# Altium schematic sheet MCU_CAN.SchDoc
size 310 x 201 mm; SheetNumber: 7; SheetTotal: 7
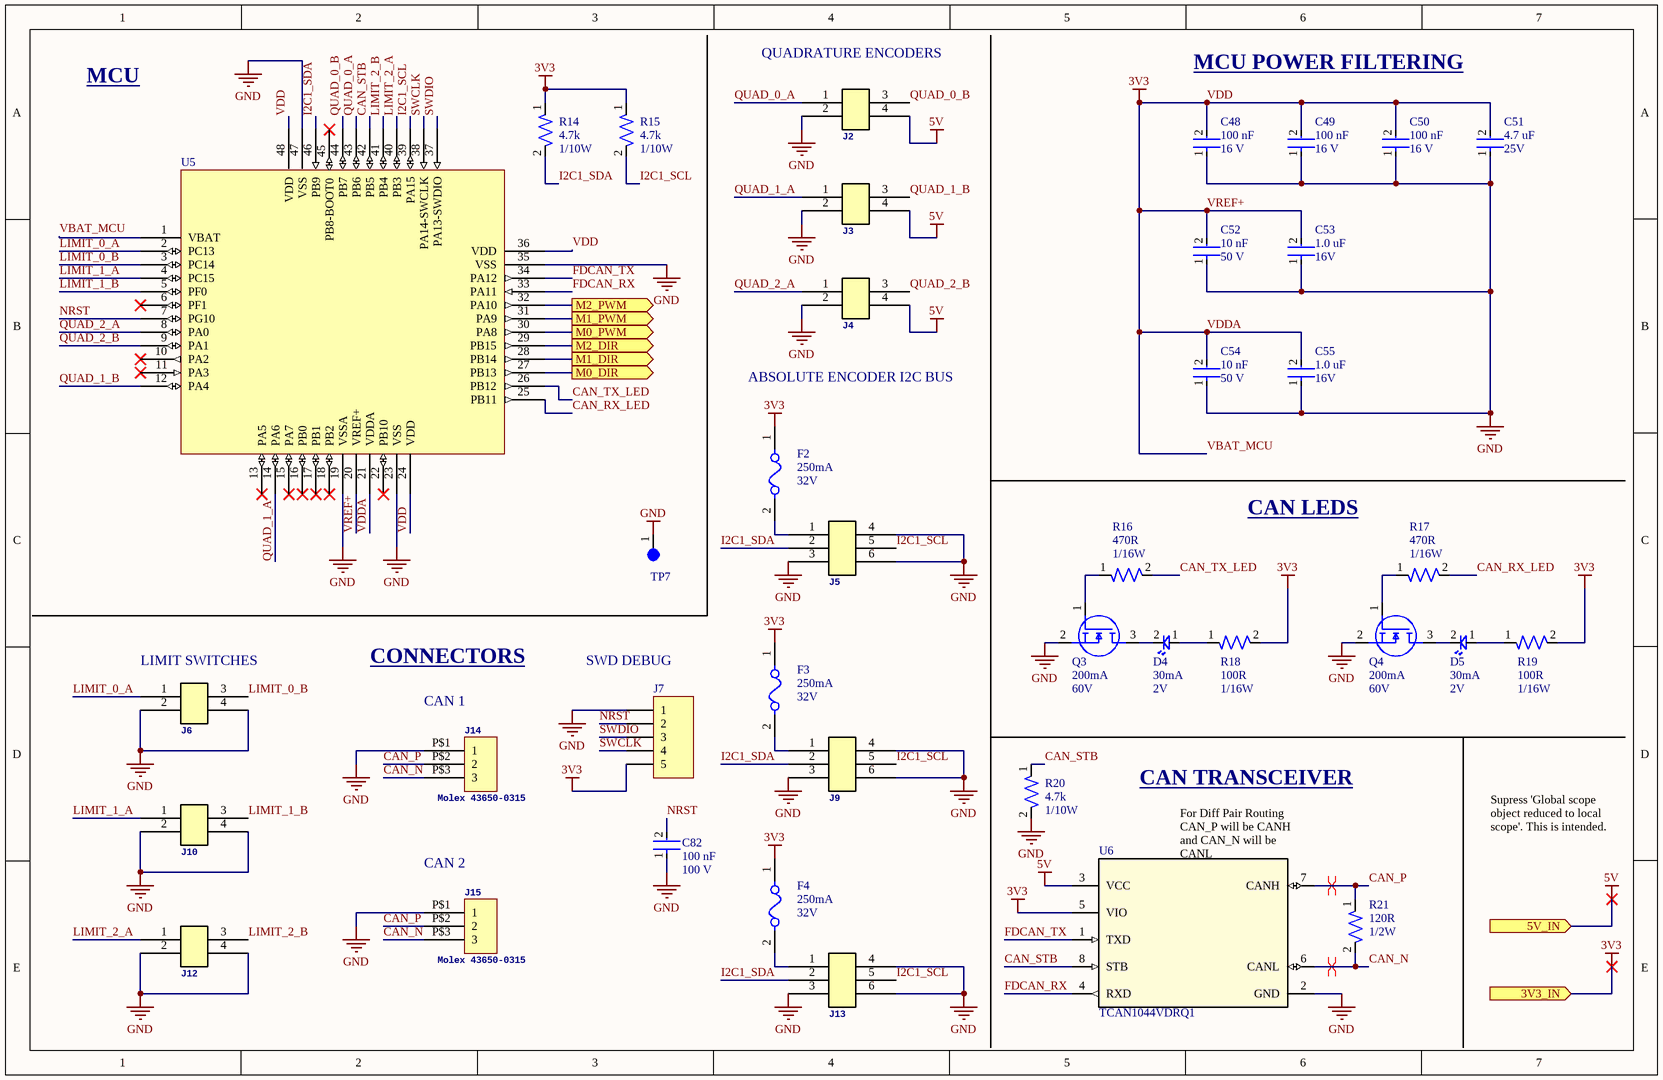
[diagram p0: MCU_CAN.SchDoc]

## Parts
C48  Voltage Rating: 16 V  Capacitance: 100 nF  [CAP-0402]  (hidden comment: CC0402KRX7R7BB104)
C49  Voltage Rating: 16 V  Capacitance: 100 nF  [CAP-0402]  (hidden comment: CC0402KRX7R7BB104)
C50  Voltage Rating: 16 V  Capacitance: 100 nF  [CAP-0402]  (hidden comment: CC0402KRX7R7BB104)
C51  Capacitance: 4.7 uF  Voltage: 25V  [CAP-0603]  (hidden comment: CC0603KRX5R8BB475)
C52  Voltage: 50 V  Capacitance: 10 nF  [CAP-0603]  (hidden comment: CC0603KPX7R9BB103)
C53  Capacitance: 1.0 uF  Voltage: 16V  [CAP-0603]  (hidden comment: CC0603KRX7R7BB105)
C54  Voltage: 50 V  Capacitance: 10 nF  [CAP-0603]  (hidden comment: CC0603KPX7R9BB103)
C55  Capacitance: 1.0 uF  Voltage: 16V  [CAP-0603]  (hidden comment: CC0603KRX7R7BB105)
C82  Capacitance: 100 nF  Voltage: 100 V  [CAP-0603]  (hidden comment: CC0603KRX7R0BB104)
D4  Forward Current: 30mA  Forward Voltage: 2V  [LED-0603]  (hidden comment: BL-HKC36G-AV-TRB)
D5  Forward Current: 30mA  Forward Voltage: 2V  [LED-0603]  (hidden comment: BL-HKC36G-AV-TRB)
F2  Fuse Current: 250mA  Voltage Rating: 32V  [RES-0603]  (hidden comment: 0467.250NRHF)
F3  Fuse Current: 250mA  Voltage Rating: 32V  [RES-0603]  (hidden comment: 0467.250NRHF)
F4  Fuse Current: 250mA  Voltage Rating: 32V  [RES-0603]  (hidden comment: 0467.250NRHF)
J2  Molex 43045-0412  [CONN-4POS-0002]  (value not drawn)
J3  Molex 43045-0412  [CONN-4POS-0002]  (value not drawn)
J4  Molex 43045-0412  [CONN-4POS-0002]  (value not drawn)
J5  Molex 43045-0612  [CONN-6POS-0001]  (value not drawn)
J6  Molex 43045-0412  [CONN-4POS-0002]  (value not drawn)
J7  Header 5  [HDR1X5]  (value not drawn)
J9  Molex 43045-0612  [CONN-6POS-0001]  (value not drawn)
J10  Molex 43045-0412  [CONN-4POS-0002]  (value not drawn)
J12  Molex 43045-0412  [CONN-4POS-0002]  (value not drawn)
J13  Molex 43045-0612  [CONN-6POS-0001]  (value not drawn)
J14  Molex 43650-0315  [43650-0315]
J15  Molex 43650-0315  [43650-0315]
Q3  Continuous Current: 200mA  Voltage: 60V  [IC-SOT23-3]  (hidden comment: T2N7002AK,LM)
Q4  Continuous Current: 200mA  Voltage: 60V  [IC-SOT23-3]  (hidden comment: T2N7002AK,LM)
R14  Power: 1/10W  Resistance: 4.7k  [RES-0603]  (hidden comment: RC0603FR-074K7L)
R15  Power: 1/10W  Resistance: 4.7k  [RES-0603]  (hidden comment: RC0603FR-074K7L)
R16  Power: 1/16W  Resistance: 470R  [RES-0402]  (hidden comment: RC0402FR-07470RL)
R17  Power: 1/16W  Resistance: 470R  [RES-0402]  (hidden comment: RC0402FR-07470RL)
R18  Power: 1/16W  Resistance: 100R  [RES-0402]  (hidden comment: RC0402FR-07100RL)
R19  Power: 1/16W  Resistance: 100R  [RES-0402]  (hidden comment: RC0402FR-07100RL)
R20  Power: 1/10W  Resistance: 4.7k  [RES-0603]  (hidden comment: RC0603FR-074K7L)
R21  Power: 1/2W  Resistance: 120R  [RES-1210]  (hidden comment: RC1210FR-07120RL)
TP7  5003  [TEST-POINT-0001]  (value not drawn)
U5  STM32G431CBT6  [IC-LQFP48]  (value not drawn)
U6  TCAN1044VDRQ1  [IC-8SOIC]

## Ports
3V3_IN (in, see TLD[2B]), 5V_IN (in, see TLD[2B], 7V_BUCK_LDOs[2B], 12V_Buck_Motor[1B]), M0_DIR (out, see TLD[2E]), M0_PWM (out, see TLD[2D]), M1_DIR (out, see TLD[2D]), M1_PWM (out, see TLD[2D]), M2_DIR (out, see TLD[2C]), M2_PWM (out, see TLD[2C])

## Nets
5V: J2.4 J3.4 J4.4 U6.3(VCC) ; port 5V_IN
GND: C48.1 C49.1 C50.1 C51.1 C52.1 C53.1 C54.1 C55.1 C82.1 J2.2 J3.2 J4.2 J5.3 J5.4 J5.6 J6.2 J6.4 J7.1 J9.3 J9.4 J9.6 J10.2 J10.4 J12.2 J12.4 J13.3 J13.4 J13.6 J14.P$1(1) J15.P$1(1) Q3.2(S) Q4.2(S) R20.2 TP7.1 U5.19(VSSA) U5.23(VSS) U5.35(VSS) U5.47(VSS) U6.2(GND)
VBAT_MCU: C48.2 C49.2 C50.2 C51.2 C52.2 C53.2 C54.2 C55.2 F2.1 F3.1 F4.1 J7.5 R14.1 R15.1 R18.2 R19.2 U5.1(VBAT) U5.20(VREF+) U5.21(VDDA) U5.24(VDD) U5.36(VDD) U5.48(VDD) U6.5(VIO) ; port 3V3_IN  [also labelled 3V3, VDD, VDDA, VREF+]
CAN_N: J14.P$3(3) J15.P$3(3) R21.2 U6.6(CANL)
CAN_P: J14.P$2(2) J15.P$2(2) R21.1 U6.7(CANH)
CAN_RX_LED: R17.2 U5.25(PB11)
CAN_STB: R20.1 U5.42(PB5) U6.8(STB)
CAN_TX_LED: R16.2 U5.26(PB12)
FDCAN_RX: U5.33(PA11) U6.4(RXD)
FDCAN_TX: U5.34(PA12) U6.1(TXD)
I2C1_SCL: J5.5 J9.5 J13.5 R15.2 U5.39(PA15)
I2C1_SDA: J5.2 J9.2 J13.2 R14.2 U5.46(PB9)
LIMIT_0_A: J6.1 U5.2(PC13)
LIMIT_0_B: J6.3 U5.3(PC14)
LIMIT_1_A: J10.1 U5.4(PC15)
LIMIT_1_B: J10.3 U5.5(PF0)
LIMIT_2_A: J12.1 U5.40(PB3)
LIMIT_2_B: J12.3 U5.41(PB4)
M0_DIR: U5.27(PB13) ; port M0_DIR
M0_PWM: U5.30(PA8) ; port M0_PWM
M1_DIR: U5.28(PB14) ; port M1_DIR
M1_PWM: U5.31(PA9) ; port M1_PWM
M2_DIR: U5.29(PB15) ; port M2_DIR
M2_PWM: U5.32(PA10) ; port M2_PWM
NRST: C82.2 J7.2 U5.7(PG10)
QUAD_0_A: J2.1 U5.43(PB6)
QUAD_0_B: J2.3 U5.44(PB7)
QUAD_1_A: J3.1 U5.14(PA6)
QUAD_1_B: J3.3 U5.12(PA4)
QUAD_2_A: J4.1 U5.8(PA0)
QUAD_2_B: J4.3 U5.9(PA1)
SWCLK: J7.4 U5.38(PA14-SWCLK)
SWDIO: J7.3 U5.37(PA13-SWDIO)
NetD4_1: D4.1 R18.1
NetD4_2: D4.2 Q3.3(D)
NetD5_1: D5.1 R19.1
NetD5_2: D5.2 Q4.3(D)
NetF2_2: F2.2 J5.1
NetF3_2: F3.2 J9.1
NetF4_2: F4.2 J13.1
NetQ3_1: Q3.1(G) R16.1
NetQ4_1: Q4.1(G) R17.1

Not connected (* = marked no-connect by the designer): U5 6(PF1)* 10(PA2)* 11(PA3)* 13(PA5)* 15(PA7)* 16(PB0)* 17(PB1)* 18(PB2)* 22(PB10)* 45(PB8-BOOT0)*

## Layout directives
differential pair: CAN_N, CAN_P

## Notes on the sheet
- MCU
- (near J2) QUADRATURE ENCODERS
- MCU POWER FILTERING
- ABSOLUTE ENCODER I2C BUS
- CAN LEDS
- (near J6) LIMIT SWITCHES
- CONNECTORS
- (near J7) SWD DEBUG
- (near J14) CAN 1
- CAN TRANSCEIVER
- (near J15) CAN 2
- (near U6) For Diff Pair Routing CAN_P will be CANH and CAN_N will be CANL
- Supress 'Global scope object reduced to local scope'. This is intended.

## Library data of the parts
C48-C50 = CAP-0.1U-0001: CAP CER 0.1UF 16V X7R 0402; ComponentLink2Description: Datasheet; ComponentLink2URL: https://www.yageo.com/upload/media/product/productsearch/datasheet/mlcc/UPY-GPHC_X7R_6.3V-to-250V_24.pdf; Device Class: Ceramic; Size: 0402
C51 = CAP-4.7U-0001: CAP CER 4.7UF 25V X5R 0603; Device Class: Ceramic; Size: 0603
C52 C54 = CAP-10N-0002: CAP CER 10000PF 50V X7R 0603; ComponentLink2Description: Datasheet; ComponentLink2URL: http://www.yageo.com/documents/recent/UPY-GPHC_X7R_6.3V-to-50V_18.pdf; Device Class: Ceramic; Size: 0603
C53 C55 = CAP-1U-0002: CAP CER 1UF 16V X7R 0603; Device Class: Ceramic; Size: 0603
C82 = CAP-100N-0001: CAP CER 0.1UF 100V X7R 0603; Device Class: Ceramic; Size: 0603; ComponentLink1Description: Datasheet; ComponentLink1URL: https://www.yageo.com/upload/media/product/app/datasheet/mlcc/upy-np0x7r_mv_100-to-630v.pdf
D4 D5 = LED-0001: LED YELLOW CLEAR 0603 SMD; ComponentLink1Description: Datasheet; ComponentLink1URL: https://www.americanbrightled.com/pdffiles/led-components/smt/BL-HKC36G-AV-TRB.pdf
F2-F4 = FUSE-0002: FUSE BRD MT 250MA 32VAC 32VDC; ComponentLink2Description: Datasheet; ComponentLink2URL: https://www.littelfuse.com/media?resourcetype=datasheets&itemid=4a59f034-1cca-460e-a5ba-e1e66247c76d&filename=littelfuse_fuse_467_datasheet.pdf
J2-J4 J6 J10 J12 = CONN-4POS-0002: CONN HEADER VERT 4POS 3MM; ComponentLink1Description: Datasheet; ComponentLink1URL: https://www.molex.com/content/dam/molex/molex-dot-com/products/automated/en-us/salesdrawingpdf/430/43045/430450412_sd.pdf?inline
J5 J9 J13 = CONN-6POS-0001: CONN HEADER VERT 6POS 3MM; ComponentLink1Description: Datasheet; ComponentLink1URL: https://tools.molex.com/pdm_docs/ps/PS-43045.pdf
J7 = Header 5: Header, 5-Pin; LatestRevisionDate: 17-Jul-2002; LatestRevisionNote: Re-released for DXP Platform.; Publisher: Altium Limited
J14 J15 = Micro-Fit Molex 3 Pin Vertical: GateName_1: G$1; SymbolName_1: HEADER_POS3; DeviceSetName: HEADER_POS3_?; DeviceName: 43650-0315; LibraryName: con-molex-micro-fit-3_0_2; Package: 43650-0315
Q3 Q4 = NMOS-200MA-0001: MOSFET N-CH 60V 200MA SOT23; ComponentLink1Description: Datasheet; ComponentLink1URL: https://toshiba.semicon-storage.com/info/T2N7002AK_datasheet_en_20150401.pdf?did=29712&prodName=T2N7002AK
R14 R15 R20 = RES-4.7k-0001: RES 4.7K OHM 1% 1/10W 0603; Tolerance: 1%; Size: 0603; ComponentLink1Description: Datasheet; ComponentLink1URL: https://www.yageo.com/upload/media/product/products/datasheet/rchip/PYu-RC_Group_51_RoHS_L_12.pdf
R16 R17 = RES-470-0001: RES 470 OHM 1% 1/16W 0402; Tolerance: 1%; Size: 0402; ComponentLink1Description: Datasheet; ComponentLink1URL: https://www.yageo.com/upload/media/product/products/datasheet/rchip/PYu-RC_Group_51_RoHS_L_12.pdf
R18 R19 = RES-100-0001: RES 100 OHM 1% 1/16W 0402; Tolerance: 1%; Size: 0402; ComponentLink1Description: Datasheet; ComponentLink1URL: https://www.yageo.com/upload/media/product/products/datasheet/rchip/PYu-RC_Group_51_RoHS_L_12.pdf
R21 = RES-120-0001: RES 120 OHM 1% 1/2W 1210; Tolerance: 1%; Size: 1210; ComponentLink1Description: Datasheet; ComponentLink1URL: https://www.yageo.com/upload/media/product/products/datasheet/rchip/PYu-RC_Group_51_RoHS_L_12.pdf
TP7 = TEST-POINT-0001: Oranange PC Test Point, Miniature Phoisphor Bronze Silver Plating Through Hole Mounting Type
U5 = IC-STM32G431CBT6: IC MCU 32BIT 128KB FLASH 48LQFP; Package: 48LQFP; ComponentLink1Description: Datasheet; ComponentLink1URL: https://www.st.com/resource/en/datasheet/stm32g431cb.pdf
U6 = IC-CAN-0001: IC TRANSCEIVER 1/1 8SOIC; ComponentLink1Description: Datasheet; ComponentLink1URL: https://www.ti.com/lit/ds/symlink/tcan1044-q1.pdf?HQS=dis-dk-null-digikeymode-dsf-pf-null-wwe&ts=1728758303289&ref_url=https%253A%252F%252Fwww.ti.com%252Fgeneral%252Fdocs%252Fsuppproductinfo.tsp%253FdistId%253D10%2526gotoUrl%253Dhttps%253A%252F%252Fwww.ti.com%252Flit%252Fgpn%252Ftcan1044-q1